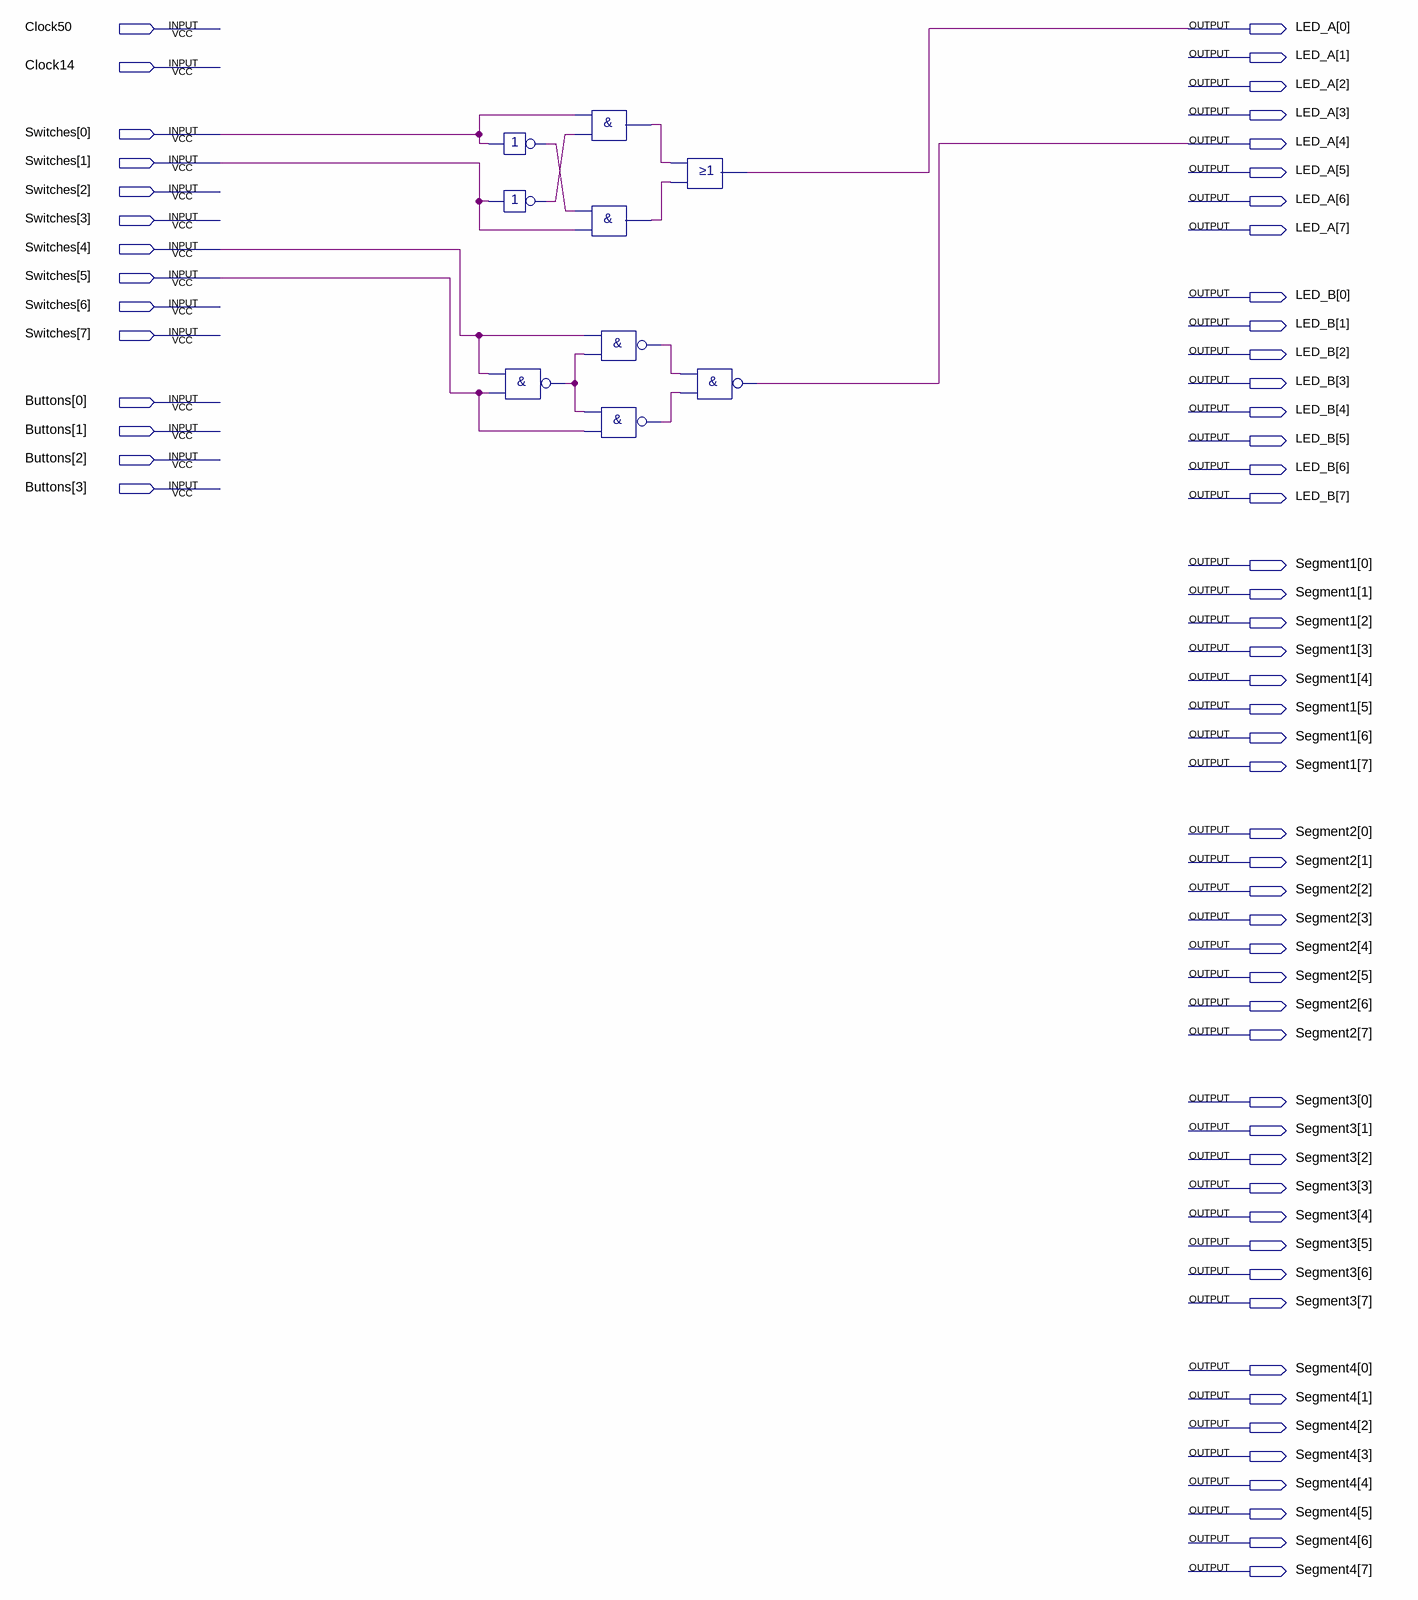
[diagram p0: schematic sheet]
// Quartus schematic EXOR.bdf as structural Verilog: 9 symbols, 62 pins
module EXOR (
  input  Clock50,
  input  Clock14,
  input  [7:0] Switches,
  input  [3:0] Buttons,
  output [7:0] LED_A,
  output [7:0] LED_B,
  output [7:0] Segment1,
  output [7:0] Segment2,
  output [7:0] Segment3,
  output [7:0] Segment4
);

  wire inst1_out, inst10_out, inst11_out, inst12_out, inst14_out, inst15_out, inst17_out;

  not inst1 (inst1_out, Switches[0]);
  not inst10 (inst10_out, Switches[1]);
  nand inst17 (inst17_out, Switches[4], Switches[5]);
  and inst11 (inst11_out, Switches[0], inst10_out);
  and inst12 (inst12_out, inst1_out, Switches[1]);
  nand inst14 (inst14_out, Switches[4], inst17_out);
  nand inst15 (inst15_out, inst17_out, Switches[5]);
  or inst13 (LED_A[0], inst11_out, inst12_out);
  nand inst16 (LED_A[4], inst14_out, inst15_out);
endmodule
